# Altium schematic sheet PLC-无线通讯版-V1.SchDoc
size A1
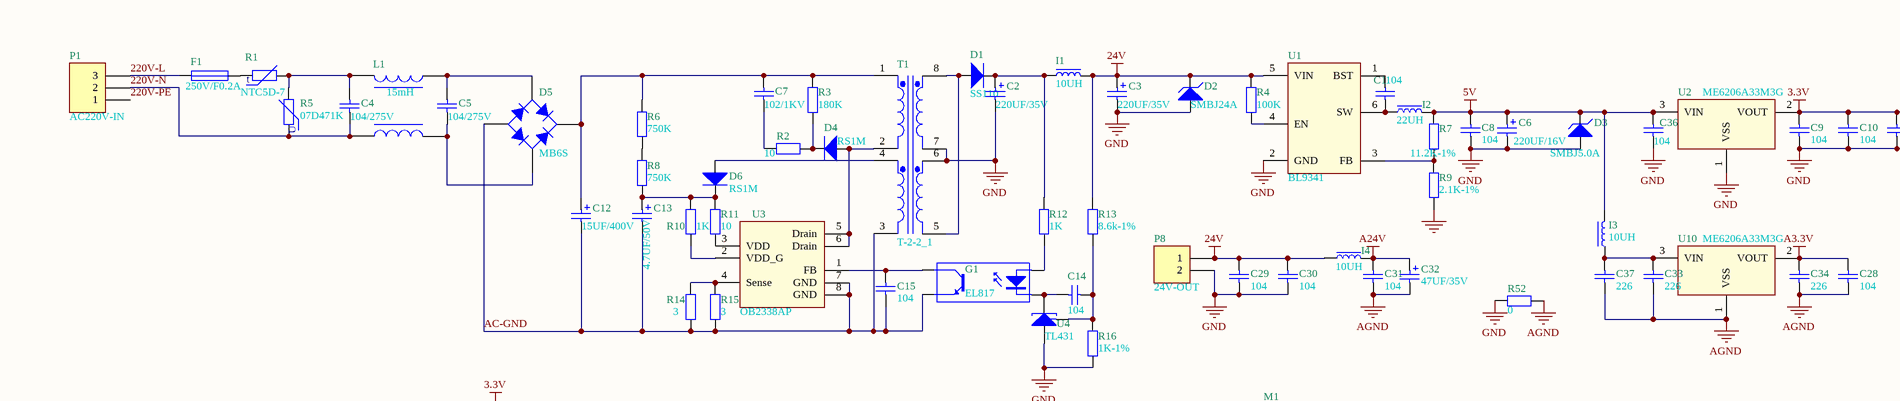
[diagram p0: PLC-无线通讯版-V1.SchDoc, top left]
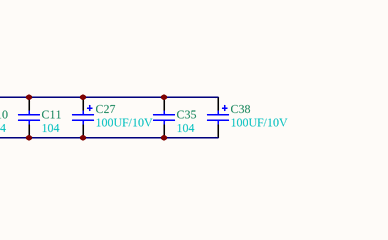
[diagram p1: PLC-无线通讯版-V1.SchDoc, top right]
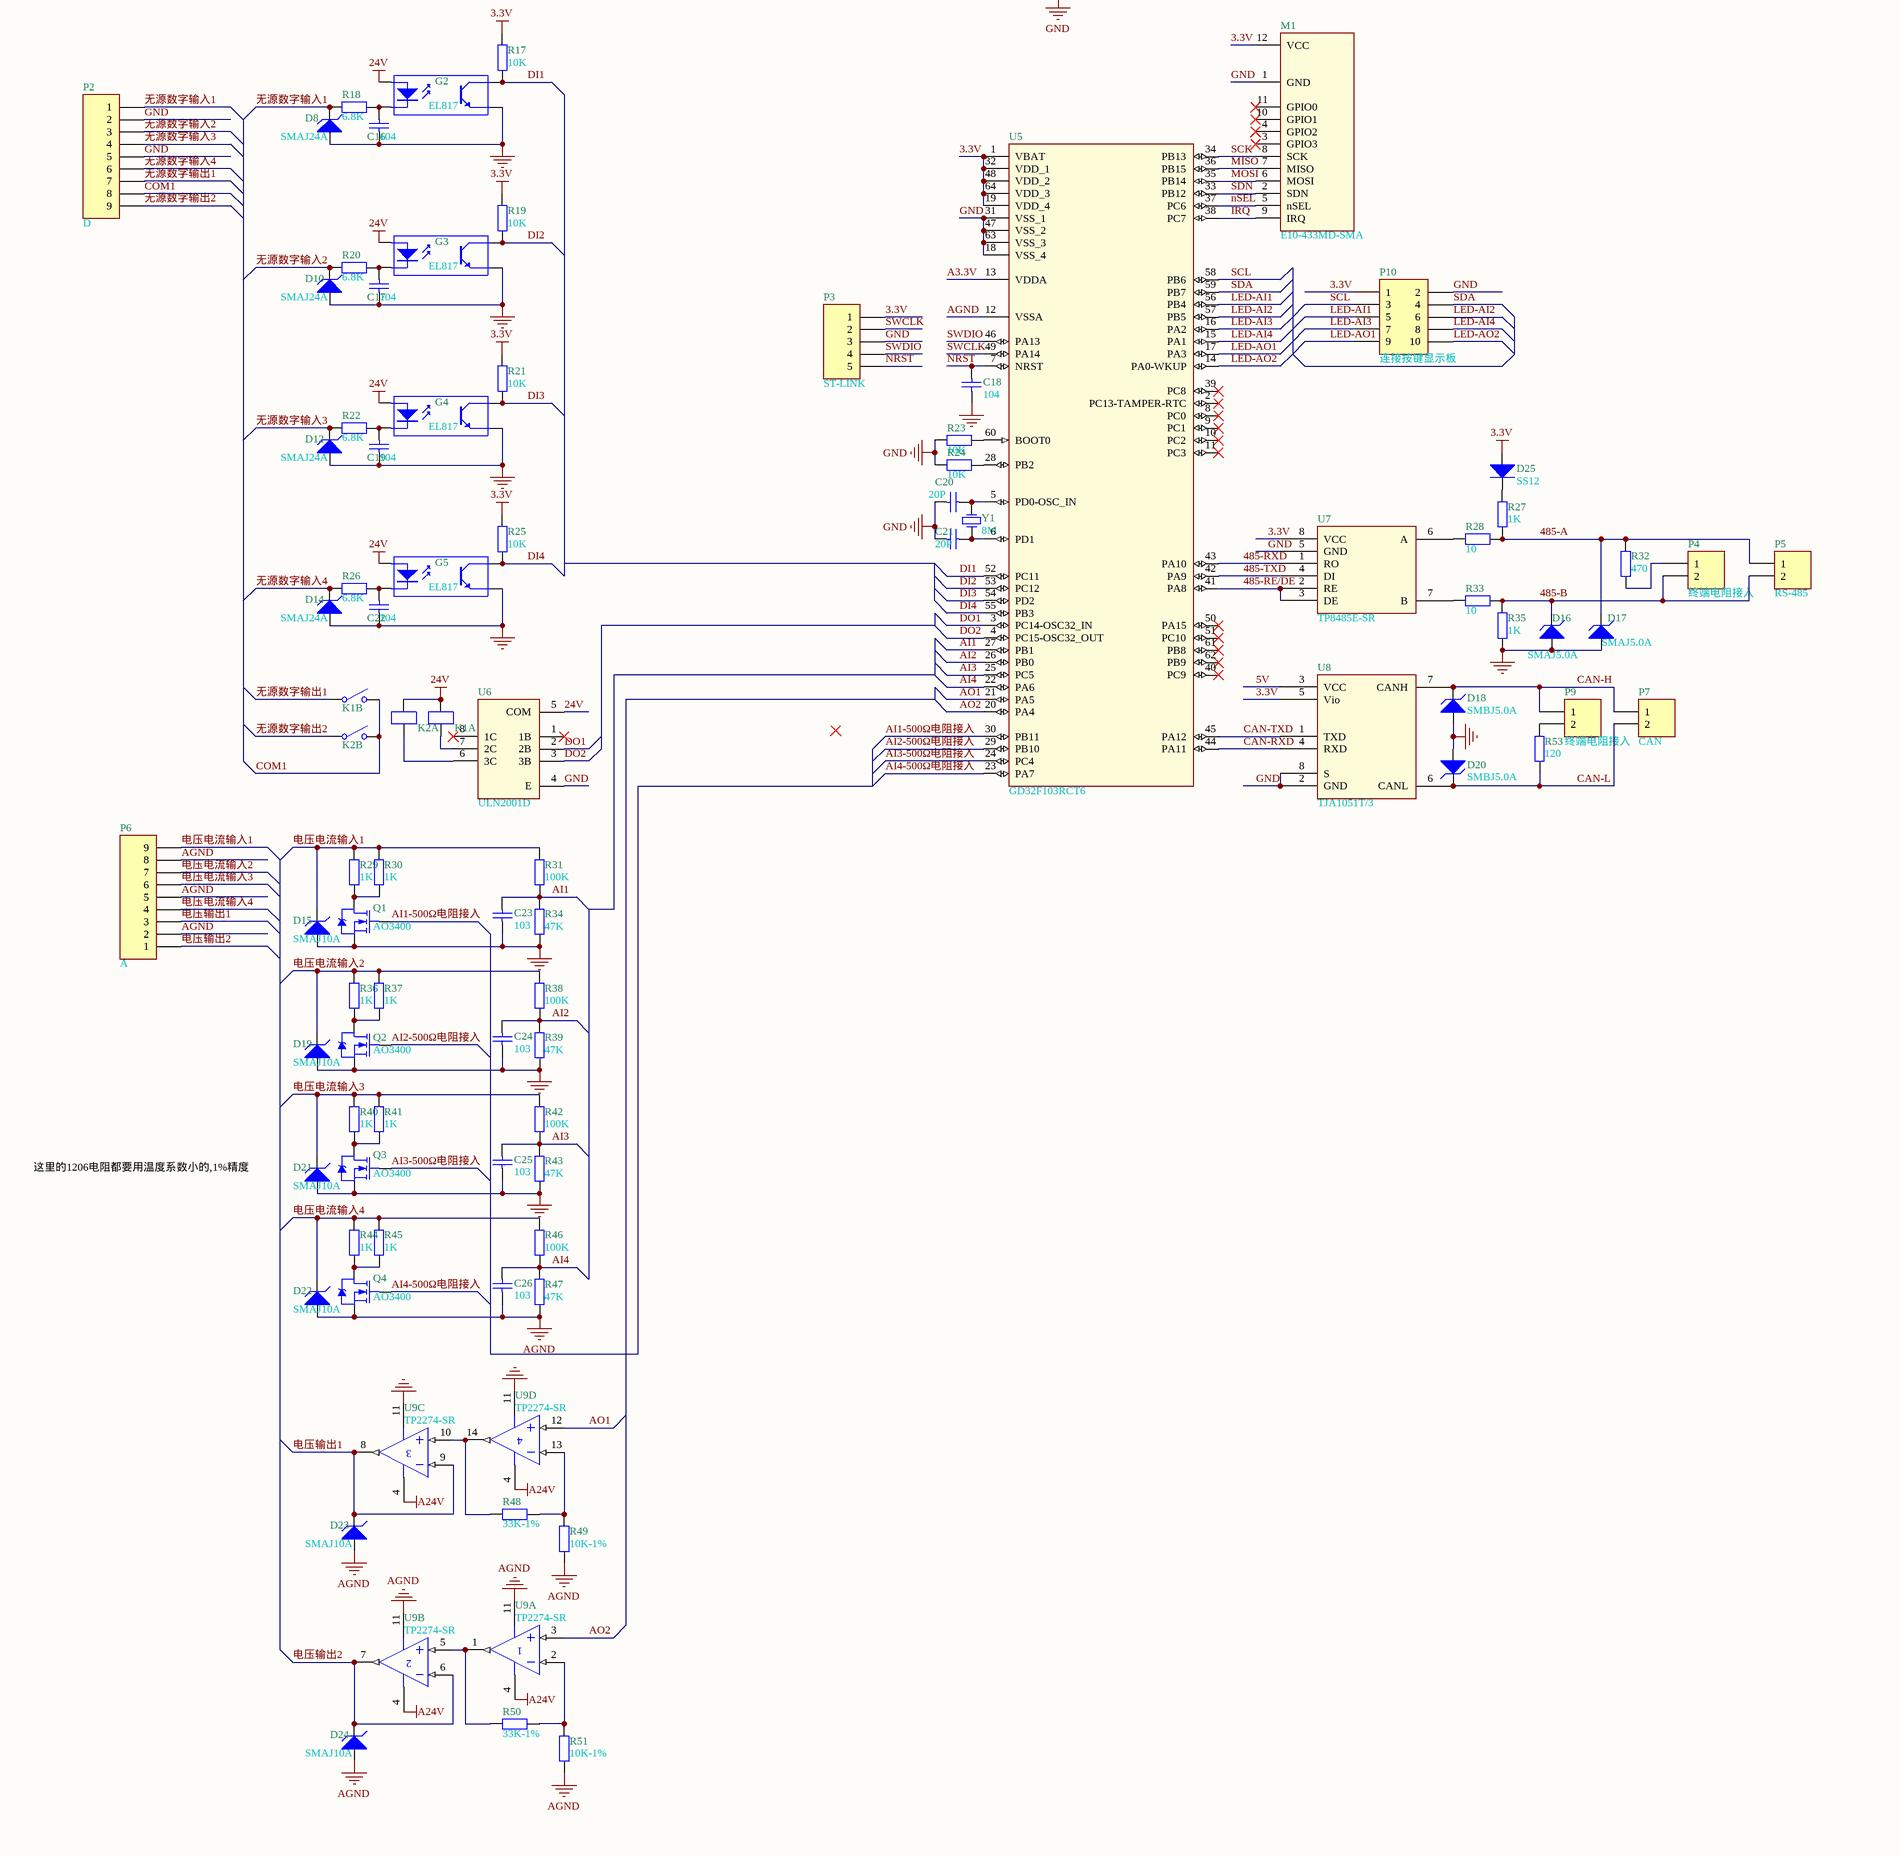
[diagram p2: PLC-无线通讯版-V1.SchDoc, bottom left]
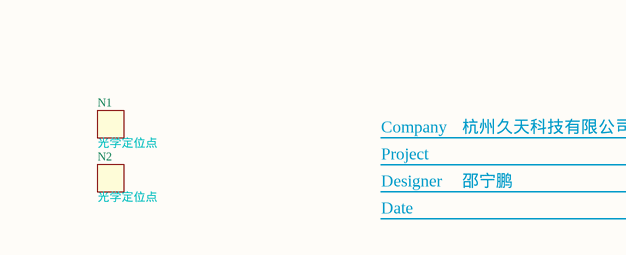
[diagram p3: PLC-无线通讯版-V1.SchDoc, bottom right]

## Parts
C1  104  [C-0603]
C2  220UF/35V  [贴片固态电容8*10-M]
C3  220UF/35V  [贴片固态电容8*10-M]
C4  104/275V  [安规电容 脚距10]
C5  104/275V  [安规电容 脚距10]
C6  220UF/16V  [贴片固态电容6.3*7.7]
C7  102/1KV  [C-1206-M]
C8  104  [C-0603]
C9  104  [C-0603]
C10  104  [C-0603]
C11  104  [C-0603]
C12  15UF/400V  [电解电容10*20蓝色]
C13  4.7UF/50V  [贴片固态电容4*5.3]
C14  104  [C-0603]
C15  104  [C-0603]
C16  104  [C-0603]
C17  104  [C-0603]
C18  104  [C-0603]
C19  104  [C-0603]
C20  20P  [C-0603]
C21  20P  [C-0603]
C22  104  [C-0603]
C23  103  [C-0603]
C24  103  [C-0603]
C25  103  [C-0603]
C26  103  [C-0603]
C27  100UF/10V  [贴片固态电容5*5.3]
C28  104  [C-0603]
C29  104  [C-0603]
C30  104  [C-0603]
C31  104  [C-0603]
C32  47UF/35V  [贴片固态电容6.3*5.3-M]
C33  226  [C-0805]
C34  226  [C-0805]
C35  104  [C-0603]
C36  104  [C-0603]
C37  226  [C-0805]
C38  100UF/10V  [贴片固态电容5*5.3]
D1  SS110  [SMA]
D2  SMBJ24A  [SMB-N]
D3  SMBJ5.0A  [SMB-N]
D4  RS1M  [SMA]
D5  MB6S  [SOIC-4-MBS]
D6  RS1M  [SMA]
D8  SMAJ24A  [SMB-N]
D10  SMAJ24A  [SMB-N]
D12  SMAJ24A  [SMB-N]
D14  SMAJ24A  [SMB-N]
D15  SMAJ10A  [SMA]
D16  SMAJ5.0A  [SMB-N]
D17  SMAJ5.0A  [SMB-N]
D18  SMBJ5.0A  [SMB-N]
D19  SMAJ10A  [SMA]
D20  SMBJ5.0A  [SMB-N]
D21  SMAJ10A  [SMA]
D22  SMAJ10A  [SMA]
D23  SMAJ10A  [SMA]
D24  SMAJ10A  [SMA]
D25  SS12  [SMA]
F1  250V/F0.2A  [FUSE-3*10带引线]
G1  EL817  [SOP-4-L]
G2  EL817  [SOP-4-L]
G3  EL817  [SOP-4-L]
G4  EL817  [SOP-4-L]
G5  EL817  [SOP-4-L]
I1  10UH  [CD43-N]
I2  22UH  [CD54]
I3  10UH  [CD43-N]
I4  10UH  [CD43-N]
K1  HF49FD-D24-1H11  [HF49FD-D24-1H11]  (value not drawn)  (parts A,B of 2)
K2  HF49FD-D24-1H11  [HF49FD-D24-1H11]  (value not drawn)  (parts A,B of 2)
L1  15mH  [UU9.8]
M1  E10-433MD-SMA  [E10-433MD-SMA]
N1  光学定位点  [MARK-1mm-3mm]
N2  光学定位点  [MARK-1mm-3mm]
P1  AC220V-IN  [KF2EDGVC-5.08-3P]
P2  D  [2EMGKG-5.08-9P]
P3  ST-LINK  [5P下载口]
P4  终端电阻接入  [HDR1X2]
P5  RS-485  [2EMGKG-5.08-2P]
P6  A  [2EMGKG-5.08-9P]
P7  CAN  [2EMGKG-5.08-2P]
P8  24V-OUT  [2EMGKG-5.08-2P]
P9  终端电阻接入  [HDR1X2]
P10  连接按键显示板  [HDR2X5-贴片母座]
Q1  AO3400  [SOT-23]
Q2  AO3400  [SOT-23]
Q3  AO3400  [SOT-23]
Q4  AO3400  [SOT-23]
R1  NTC5D-7  [NTC-5D-7]
R2  10  [R-0805]
R3  180K  [R-1206-M]
R4  100K  [R-0603]
R5  07D471K  [MOV-07D]
R6  750K  [R-1206-M]
R7  11.2K-1%  [R-0603]
R8  750K  [R-1206-M]
R9  2.1K-1%  [R-0603]
R10  1K  [R-0603]
R11  10  [R-0603]
R12  1K  [R-0603]
R13  8.6k-1%  [R-0603]
R14  3  [R-1206-M]
R15  3  [R-1206-M]
R16  1K-1%  [R-0603]
R17  10K  [R-0603]
R18  6.8K  [R-0603]
R19  10K  [R-0603]
R20  6.8K  [R-0603]
R21  10K  [R-0603]
R22  6.8K  [R-0603]
R23  10K  [R-0603]
R24  10K  [R-0603]
R25  10K  [R-0603]
R26  6.8K  [R-0603]
R27  1K  [R-0603]
R28  10  [R-0805-M]
R29  1K  [R-1206-M]
R30  1K  [R-1206-M]
R31  100K  [R-1206-M]
R32  470  [R-1206-M]
R33  10  [R-0805-M]
R34  47K  [R-1206-M]
R35  1K  [R-0603]
R36  1K  [R-1206-M]
R37  1K  [R-1206-M]
R38  100K  [R-1206-M]
R39  47K  [R-1206-M]
R40  1K  [R-1206-M]
R41  1K  [R-1206-M]
R42  100K  [R-1206-M]
R43  47K  [R-1206-M]
R44  1K  [R-1206-M]
R45  1K  [R-1206-M]
R46  100K  [R-1206-M]
R47  47K  [R-1206-M]
R48  33K-1%  [R-0603]
R49  10K-1%  [R-0603]
R50  33K-1%  [R-0603]
R51  10K-1%  [R-0603]
R52  0  [R-0603]
R53  120  [R-1206]
T1  T-2-2_1  [EE19-卧式]
U1  BL9341  [SOT-23-6-N]
U2  ME6206A33M3G  [SOT-23]
U3  OB2338AP  [DIP8]
U4  TL431  [SOT-23]
U5  GD32F103RCT6  [LQFP64-M]
U6  ULN2001D  [SOP-8-M]
U7  TP8485E-SR  [SOP-8-N]
U8  TJA1051T/3  [SOP-8-N]
U9  TP2274-SR  [SOP-14-M]  (parts A,B,C,D of 4)
U10  ME6206A33M3G  [SOT-23]
Y1  8M  [HC-49SMD]

## Nets
3.3V: C9.2 C10.2 C11.2 C27.1 C35.2 C38.1 D25.1(A) M1.12(VCC) P3.1 P10.1 R17.2 R19.2 R21.2 R25.2 U2.2(VOUT) U5.1(VBAT) U5.19(VDD_4) U5.32(VDD_1) U5.48(VDD_2) U5.64(VDD_3) U7.8(VCC) U8.5(Vio)
5V: C6.1 C8.2 C36.2 D3.2(K) I2.2 I3.2 R7.1 U2.3(VIN) U8.3(VCC)
24V: C3.1 C29.2 C30.2 D2.2(K) G2.1(A) G3.1(A) G4.1(A) G5.1(A) I1.2 I4.1 K1.1 K2.1 P8.1 R4.1 R13.2 U1.5(VIN) U6.5(COM)
A3.3V: C28.2 C34.2 U5.13(VDDA) U10.2(VOUT)
A24V: C31.2 C32.1 I4.2 U9.4(V+)
AGND: C23.1 C24.1 C25.1 C26.1 C28.1 C31.1 C32.2 C33.1 C34.1 C37.1 D15.1(A) D19.1(A) D21.1(A) D22.1(A) D23.1(A) D24.1(A) P6.2 P6.5 P6.8 Q1.2(S) Q2.2(S) Q3.2(S) Q4.2(S) R34.1 R39.1 R43.1 R47.1 R49.2 R51.2 R52.2 U5.12(VSSA) U9.11(V-) U10.1(VSS)
GND: C2.2 C3.2 C6.2 C8.1 C9.1 C10.1 C11.1 C16.1 C17.1 C18.1 C19.1 C20.1 C21.1 C22.1 C27.2 C29.1 C30.1 C35.1 C36.1 C38.2 D2.1(A) D3.1(A) D8.1(A) D10.1(A) D12.1(A) D14.1(A) D16.1(A) D17.1(A) D18.1(A) D20.1(A) G2.3(E) G3.3(E) G4.3(E) G5.3(E) M1.1(GND) P2.2 P2.5 P3.3 P8.2 P10.2 R9.2 R16.1 R23.2 R24.2 R35.1 R52.1 T1.6 T1.7 U1.2(GND) U2.1(VSS) U4.3(A) U5.18(VSS_4) U5.31(VSS_1) U5.47(VSS_2) U5.63(VSS_3) U6.4(E) U7.5(GND) U8.2(GND) U8.8(S)
220V-L: F1.1 P1.3
220V-N: C4.2 L1.1 P1.2 R5.1
220V-PE: P1.1
485-A: D17.2(K) P5.1 R27.2 R28.1 R32.1
485-B: D16.2(K) P4.2 P5.2 R33.1 R35.2
485-RE/DE: U5.41(PA8) U7.2(RE) U7.3(DE)
485-RXD: U5.43(PA10) U7.1(RO)
485-TXD: U5.42(PA9) U7.4(DI)
AC-GND: C12.2 C13.2 C15.1 D5.4(A) G1.3(E) R14.1 R15.1 T1.3 U3.7(GND) U3.8(GND)
AI1: C23.2 R31.1 R34.2 U5.27(PB1)
AI1-500Ω电阻接入: Q1.1(G) U5.30(PB11)
AI2: C24.2 R38.1 R39.2 U5.26(PB0)
AI2-500Ω电阻接入: Q2.1(G) U5.29(PB10)
AI3: C25.2 R42.1 R43.2 U5.25(PC5)
AI3-500Ω电阻接入: Q3.1(G) U5.24(PC4)
AI4: C26.2 R46.1 R47.2 U5.22(PA6)
AI4-500Ω电阻接入: Q4.1(G) U5.23(PA7)
AO1: U5.21(PA5) U9.12(IN+)
AO2: U5.20(PA4) U9.3(IN+)
CAN-H: D18.2(K) P7.1 P9.1 U8.7(CANH)
CAN-L: D20.2(K) P7.2 R53.2 U8.6(CANL)
CAN-RXD: U5.44(PA11) U8.4(RXD)
CAN-TXD: U5.45(PA12) U8.1(TXD)
COM1: K1.4 K2.4 P2.8
DI1: G2.4(C) R17.1 U5.52(PC11)
DI2: G3.4(C) R19.1 U5.53(PC12)
DI3: G4.4(C) R21.1 U5.54(PD2)
DI4: G5.4(C) R25.1 U5.55(PB3)
DO1: U5.3(PC14-OSC32_IN) U6.2(2B)
DO2: U5.4(PC15-OSC32_OUT) U6.3(3B)
IRQ: M1.9(IRQ) U5.38(PC7)
LED-AI1: P10.5 U5.56(PB4)
LED-AI2: P10.6 U5.57(PB5)
LED-AI3: P10.7 U5.16(PA2)
LED-AI4: P10.8 U5.15(PA1)
LED-AO1: P10.9 U5.17(PA3)
LED-AO2: P10.10 U5.14(PA0-WKUP)
MISO: M1.7(MISO) U5.36(PB15)
MOSI: M1.6(MOSI) U5.35(PB14)
NRST: C18.2 P3.5 U5.7(NRST)
nSEL: M1.5(nSEL) U5.37(PC6)
SCK: M1.8(SCK) U5.34(PB13)
SCL: P10.3 U5.58(PB6)
SDA: P10.4 U5.59(PB7)
SDN: M1.2(SDN) U5.33(PB12)
SWCLK: P3.2 U5.49(PA14)
SWDIO: P3.4 U5.46(PA13)
无源数字输入1: D8.2(K) P2.1 R18.1
无源数字输入2: D10.2(K) P2.3 R20.1
无源数字输入3: D12.2(K) P2.4 R22.1
无源数字输入4: D14.2(K) P2.6 R26.1
无源数字输出1: K1.3 P2.7
无源数字输出2: K2.3 P2.9
电压电流输入1: D15.2(K) P6.9 R29.2 R30.2 R31.2
电压电流输入2: D19.2(K) P6.7 R36.2 R37.2 R38.2
电压电流输入3: D21.2(K) P6.6 R40.2 R41.2 R42.2
电压电流输入4: D22.2(K) P6.4 R44.2 R45.2 R46.2
电压输出1: D23.2(K) P6.3 U9.8(OUT) U9.9(IN-)
电压输出2: D24.2(K) P6.1 U9.6(IN-) U9.7(OUT)
NetC1_1: C1.1 I2.1 U1.6(SW)
NetC1_2: C1.2 U1.1(BST)
NetC2_1: C2.1 D1.2(K) I1.1 R12.2
NetC4_1: C4.1 L1.4 R1.2 R5.2
NetC5_1: C5.1 D5.2(C) L1.3
NetC5_2: C5.2 D5.1(C) L1.2
NetC7_1: C7.1 R2.1
NetC7_2: C7.2 C12.1 D5.3(K) R3.2 R6.1 T1.1
NetC13_1: C13.1 D6.2(K) R8.2 R10.2 R11.2
NetC14_1: C14.1 G1.2(K) U4.2(K)
NetC14_2: C14.2 R13.1 R16.2 U4.1(REF)
NetC15_2: C15.2 G1.4(C) U3.1(FB)
NetC16_2: C16.2 G2.2(K) R18.2
NetC17_2: C17.2 G3.2(K) R20.2
NetC19_2: C19.2 G4.2(K) R22.2
NetC20_2: C20.2 U5.5(PD0-OSC_IN) Y1.2(OSC2)
NetC21_2: C21.2 U5.6(PD1) Y1.1(OSC1)
NetC22_2: C22.2 G5.2(K) R26.2
NetC33_2: C33.2 C37.2 I3.1 U10.3(VIN)
NetD1_1: D1.1(A) T1.5 T1.8
NetD4_1: D4.1(A) T1.2 U3.5(Drain) U3.6(Drain)
NetD4_2: D4.2(K) R2.2 R3.1
NetD6_1: D6.1(A) T1.4
NetD25_2: D25.2(K) R27.1
NetF1_2: F1.2 R1.1
NetG1_1: G1.1(A) R12.1
NetK1_2: K1.2 U6.7(2C)
NetK2_2: K2.2 U6.6(3C)
NetP4_1: P4.1 R32.2
NetP9_2: P9.2 R53.1
NetQ1_3: Q1.3(D) R29.1 R30.1
NetQ2_3: Q2.3(D) R36.1 R37.1
NetQ3_3: Q3.3(D) R40.1 R41.1
NetQ4_3: Q4.3(D) R44.1 R45.1
NetR4_2: R4.2 U1.4(EN)
NetR6_2: R6.2 R8.1
NetR7_2: R7.2 R9.1 U1.3(FB)
NetR10_1: R10.1 U3.2(VDD_G)
NetR11_1: R11.1 U3.3(VDD)
NetR14_2: R14.2 R15.2 U3.4(Sense)
NetR23_1: R23.1 U5.60(BOOT0)
NetR24_1: R24.1 U5.28(PB2)
NetR28_2: R28.2 U7.6(A)
NetR33_2: R33.2 U7.7(B)
NetR48_1: R48.1 R49.1 U9.13(IN-)
NetR48_2: R48.2 U9.10(IN+) U9.14(OUT)
NetR50_1: R50.1 R51.1 U9.2(IN-)
NetR50_2: R50.2 U9.1(OUT) U9.5(IN+)

Not connected (* = marked no-connect by the designer): M1 3(GPIO3)* 4(GPIO2)* 10(GPIO1)* 11(GPIO0)*; U5 2(PC13-TAMPER-RTC)* 8(PC0)* 9(PC1)* 10(PC2)* 11(PC3)* 39(PC8)* 40(PC9)* 50(PA15)* 51(PC10)* 61(PB8)* 62(PB9)*; U6 1(1B)* 8(1C)*

## Notes on the sheet
- 这里的1206电阻都要用温度系数小的,1%精度
- Project
- Company
- 杭州久天科技有限公司
- Designer
- Date
- 邵宁鹏
- (in symbol 压敏电阻) U
- (in symbol 热敏电阻) t

## Library data of the parts
C1 C4 C5 C8-C11 C14 C15 C28-C31 C33-C37 = Cap: Capacitor; Published: 8-Jun-2000; LatestRevisionDate: 17-Jul-2002; LatestRevisionNote: Re-released for DXP Platform.; PackageReference: RAD-0.3; Publisher: Altium Limited
C2 C3 C12 C13 = Cap Pol1: 电解电容; Published: 8-Jun-2000; LatestRevisionDate: 17-Jul-2002; LatestRevisionNote: Re-released for DXP Platform.; PackageReference: RB7.6-15; Publisher: Altium Limited
C6 C27 C32 C38 = Cap Pol1: Polarized Capacitor (Radial); Published: 8-Jun-2000; LatestRevisionDate: 17-Jul-2002; LatestRevisionNote: Re-released for DXP Platform.; PackageReference: RB7.6-15; Publisher: Altium Limited
C7 C16-C26 = Cap-0603: 0805; Published: 8-Jun-2000; LatestRevisionDate: 17-Jul-2002; LatestRevisionNote: Re-released for DXP Platform.; PackageReference: RAD-0.3; Publisher: Altium Limited
D1 D4 D6 D25 = SS14: SMA
D2 D3 D8 D10 D12 D14-D24 = TVS-1: SMB
D5 = MB6S: 整流桥堆 MB05S-MB10S
F1 = Fuse 1: Fuse; Published: 8-Jun-2000; LatestRevisionDate: 17-Jul-2002; LatestRevisionNote: Re-released for DXP Platform.; PackageReference: PIN-W2/E2.8; Publisher: Altium Limited
I1-I4 = Inductance3
L1 = 共模电感UU9.8
N1 N2 = 无引脚
P1 = Header 3: Header, 3-Pin; LatestRevisionDate: 17-Jul-2002; LatestRevisionNote: Re-released for DXP Platform.; Publisher: Altium Limited
P2 P6 = Header 9: Header, 9-Pin; LatestRevisionDate: 17-Jul-2002; LatestRevisionNote: Re-released for DXP Platform.; Publisher: Altium Limited
P3 = Header 5: Header, 5-Pin; LatestRevisionDate: 17-Jul-2002; LatestRevisionNote: Re-released for DXP Platform.; Publisher: Altium Limited
P4 P5 P7-P9 = Header 2: Header, 2-Pin; LatestRevisionDate: 17-Jul-2002; LatestRevisionNote: Re-released for DXP Platform.; Publisher: Altium Limited
P10 = Header 5X2: Header, 5-Pin, Dual row; LatestRevisionDate: 17-Jul-2002; LatestRevisionNote: Re-released for DXP Platform.; Publisher: Altium Limited
Q1-Q4 = AO3400: SOT-23
R1 = 热敏电阻: Published: 24-Mar-1999; LatestRevisionDate: 29-May-2009; LatestRevisionNote: IPC-7351 Footprint Added.; PackageVersion: Mar-2003; PackageReference: 6-0805; Publisher: Altium Limited; PackageDescription: Chip Resistor 0805 Case Size; Code_IPC: RESC2012
R2-R4 R7 R9-R11 R14 R15 R17-R26 R29-R31 R34 R36-R52 = Res2-0603: 0603; Published: 8-Jun-2000; LatestRevisionDate: 17-Jul-2002; LatestRevisionNote: Re-released for DXP Platform.; PackageReference: AXIAL-0.4; Publisher: Altium Limited
R5 = 压敏电阻
R6 R8 R12 R13 R16 = Res2: 1%; Published: 8-Jun-2000; LatestRevisionDate: 17-Jul-2002; LatestRevisionNote: Re-released for DXP Platform.; PackageReference: AXIAL-0.4; Publisher: Altium Limited
R27 R35 = Res2: Resistor; Published: 8-Jun-2000; LatestRevisionDate: 17-Jul-2002; LatestRevisionNote: Re-released for DXP Platform.; PackageReference: AXIAL-0.4; Publisher: Altium Limited
R28 R32 R33 R53 = Res2: Resistor; Value: 1K; Published: 8-Jun-2000; LatestRevisionDate: 17-Jul-2002; LatestRevisionNote: Re-released for DXP Platform.; PackageReference: AXIAL-0.4; Publisher: Altium Limited
U2 U10 = ME6206A33M3G: LDO稳压 SOT-23
U4 = TL431: 稳压芯片 SOT-23
U5 = STM32F103RBT6
U7 = MAX3082: RS485总线转串口
U9 = MCP6004: 四运放-SOP-14
Y1 = 晶振
G1-G5 = EL817: Published: 24-Mar-1999; LatestRevisionDate: 04-Mar-2005; LatestRevisionNote: Sch pins 3 & 4 Swapped.; DatasheetVersion: Nov-2003; PackageReference: DIP-4; Publisher: Altium Limited